# EAGLE design x0x-heart-power (EAGLE 7.2.0)
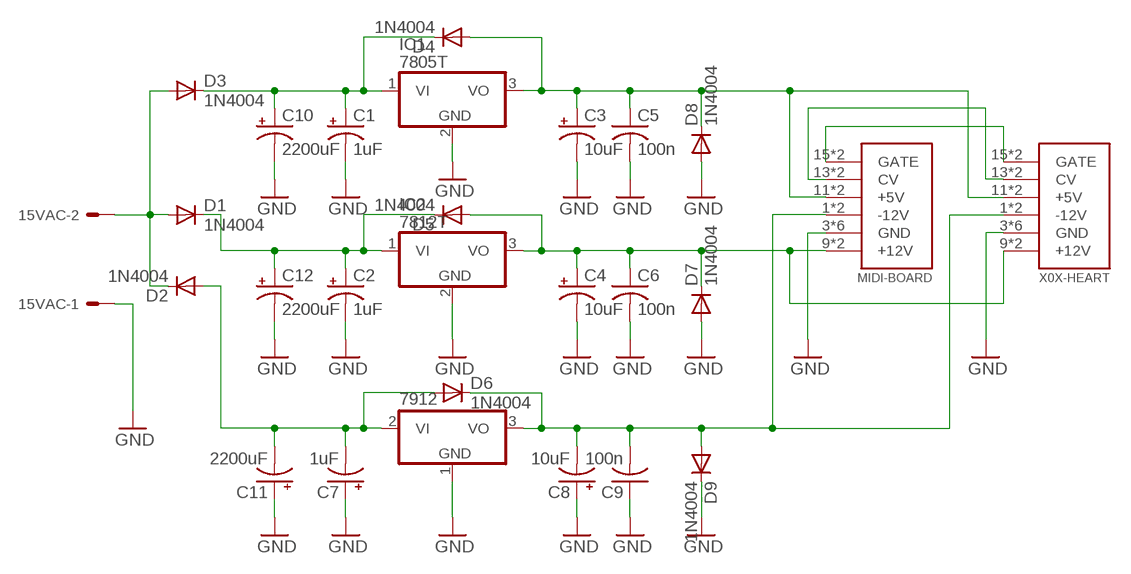
[diagram p0: schematic, sheet 1]

## Parts
15VAC  KK-156-2  [KK-156-2]
7912  7912T  [TO220H]
C1  1uF  CPOL-USE2-5  [E2-5]
C2  1uF  CPOL-USE2-5  [E2-5]
C3  10uF  CPOL-USE2-5  [E2-5]
C4  10uF  CPOL-USE2-5  [E2-5]
C5  100n  C-US025-024X044  [C025-024X044]
C6  100n  C-US025-024X044  [C025-024X044]
C7  1uF  CPOL-USE2-5  [E2-5]
C8  10uF  CPOL-USE2-5  [E2-5]
C9  100n  C-US025-024X044  [C025-024X044]
C10  2200uF  CPOL-USE22-6AXIAL  [E22-6]
C11  2200uF  CPOL-USE22-6AXIAL  [E22-6]
C12  2200uF  CPOL-USE22-6AXIAL  [E22-6]
D1  1N4004  [DO41-10]
D2  1N4004  [DO41-10]
D3  1N4004  [DO41-10]
D4  1N4004  [DO41-10]
D5  1N4004  [DO41-10]
D6  1N4004  [DO41-10]
D7  1N4004  [DO41-10]
D8  1N4004  [DO41-10]
D9  1N4004  [DO41-10]
IC1  7805T  [TO220H]
IC2  7812T  [TO220H]
MIDI-BOARD  POWER  [POWER_16]
X0X-HEART  POWER  [POWER_16]

## Nets
GND: 15VAC.1 7912.1(GND) C1.- C2.- C3.- C4.- C5.2 C6.2 C7.+ C8.+ C9.1 C10.- C11.+ C12.- D7.A D8.A D9.C IC1.2(GND) IC2.2(GND) MIDI-BOARD.3(GND) MIDI-BOARD.4(GND) MIDI-BOARD.5(GND) MIDI-BOARD.6(GND) MIDI-BOARD.7(GND) MIDI-BOARD.8(GND) X0X-HEART.3(GND) X0X-HEART.4(GND) X0X-HEART.5(GND) X0X-HEART.6(GND) X0X-HEART.7(GND) X0X-HEART.8(GND)
N$1: MIDI-BOARD.15(GATE) MIDI-BOARD.16(GATE) X0X-HEART.15(GATE) X0X-HEART.16(GATE)
N$2: MIDI-BOARD.13(CV) MIDI-BOARD.14(CV) X0X-HEART.13(CV) X0X-HEART.14(CV)
N$3: C3.+ C5.1 D4.A D8.C IC1.3(VO) MIDI-BOARD.11(+5V) MIDI-BOARD.12(+5V) X0X-HEART.11(+5V) X0X-HEART.12(+5V)
N$4: 7912.2(VI) C7.- C11.- D2.A D6.A
N$5: 7912.3(VO) C8.- C9.2 D6.C D9.A MIDI-BOARD.1(-12V) MIDI-BOARD.2(-12V) X0X-HEART.1(-12V) X0X-HEART.2(-12V)
N$6: C1.+ C10.+ D3.C D4.C IC1.1(VI)
N$7: C4.+ C6.1 D5.A D7.C IC2.3(VO) MIDI-BOARD.9(+12V) MIDI-BOARD.10(+12V) X0X-HEART.9(+12V) X0X-HEART.10(+12V)
N$8: C2.+ C12.+ D1.C D5.C IC2.1(VI)
N$9: 15VAC.2 D1.A D2.C D3.A

## Library data of the parts
15VAC = con-molex:KK-156-2: KK 156 HEADER Source: http://www.molex.com/pdm_docs/sd/026604100_sd.pdf; OC_FARNELL: unknown; OC_NEWARK: unknown
7912 = linear:79*: Negative VOLTAGE REGULATOR
C1-C4 C7 C8 C10-C12 = rcl:CPOL-US: POLARIZED CAPACITOR, American symbol
C5 C6 C9 = rcl:C-US: CAPACITOR, American symbol
D1-D9 = diode:1N4004: DIODE general purpose rectifier, 1 A
IC1 IC2 = adafruit:78*: Positive VOLTAGE REGULATOR Added bigger pads to the TO-92 package
MIDI-BOARD X0X-HEART = eurorack:POWER

## Board
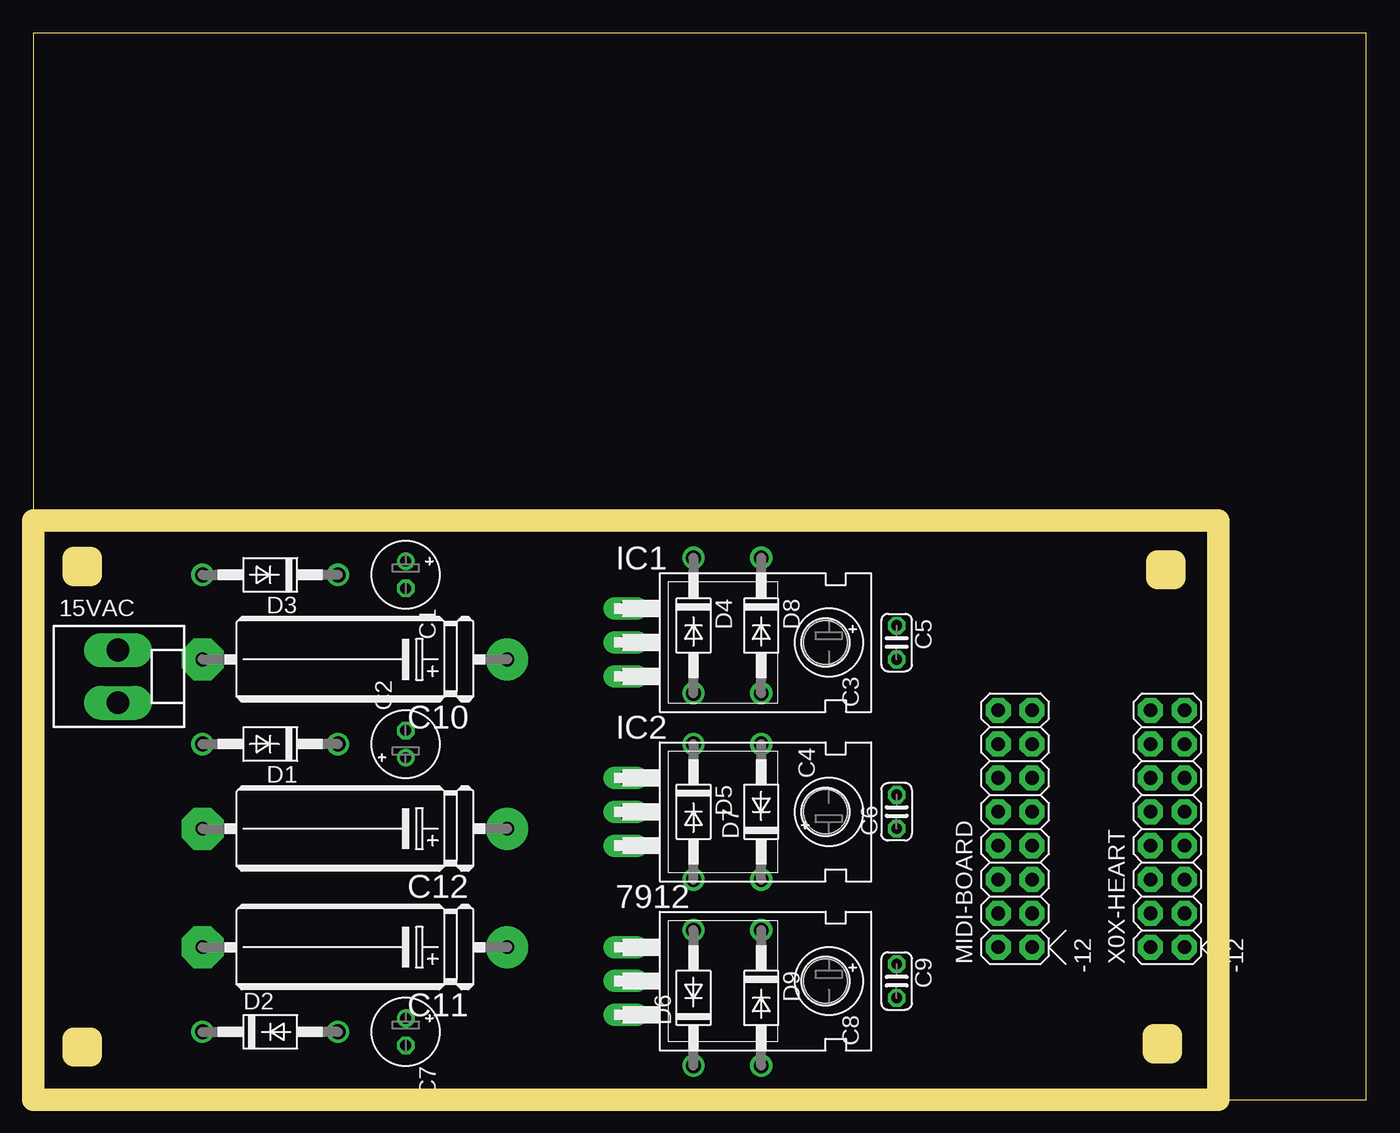
[diagram p1: board, top side]
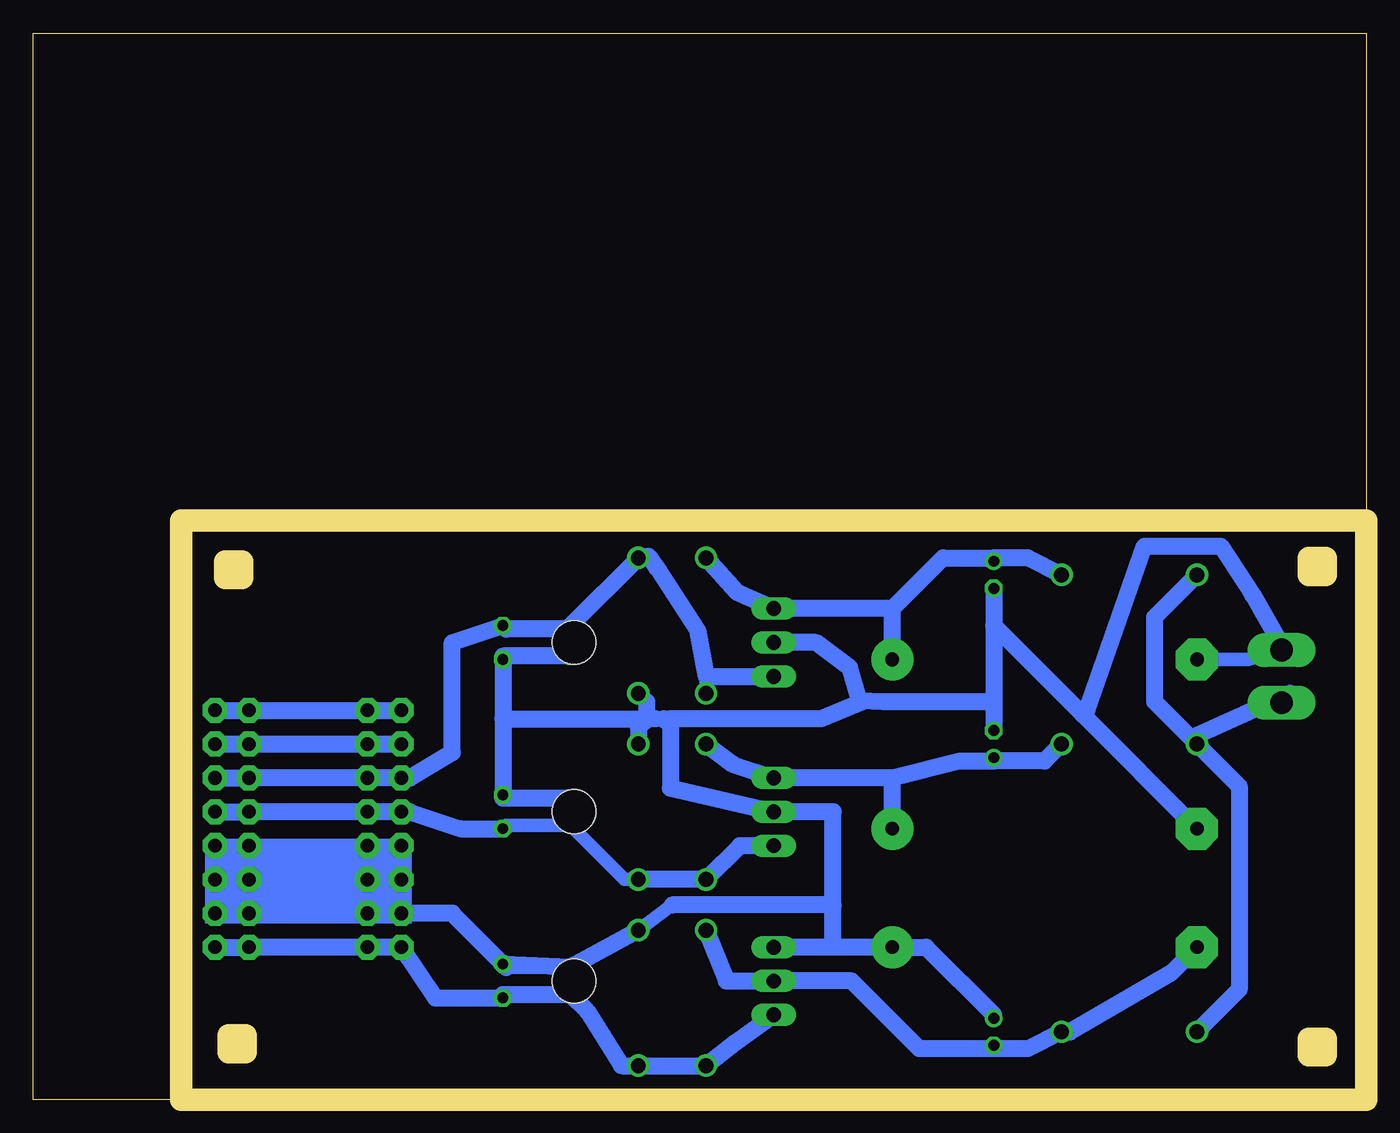
[diagram p2: board, bottom side, seen from below]

Size 100 x 80 mm. Coordinates in mm from the lower left corner, seen from the top.
Outline: 0,0 100,0 100,80 0,80 0,0
Copper layers (1*16): Top 0.035mm / dielectric 1.5mm / Bottom 0.035mm
Design rules "default *": minimum track width 40mil, minimum drill 31mil, track to track 22mil, track to pad 22mil, pad to pad 22mil, via to via 22mil, smd to smd 8mil, copper to edge 0mil, drill to drill 22mil, minimum pad ring 10mil, minimum via ring 8mil, stop-mask expansion 4mil, vias tented up to drill 0mil, thermal gap 10mil
Milling: 20 lines

### Footprints (pad centres in the part's own frame; a part is rotated, then mirrored left to right if it is on the bottom)
KK-156-2 = drill 1.7 pad 2.184 long: 1 -1.98,0; 2 1.98,0
TO220H = drill 1.118 long: 1 -2.54,-10.16; 2 0,-10.16; 3 2.54,-10.16 | hole 3.302: 0,4.826
E2-5 = drill 0.813 pad 1.27: + -1.016,0 | drill 0.813 pad 1.27 octagon: - 1.016,0
C025-024X044 = drill 0.813 octagon: 1 -1.27,0; 2 1.27,0
E22-6 = drill 1.016 pad 3.15: + -11.43,0 | drill 1.016 pad 3.15 octagon: - 11.43,0
DO41-10 = drill 1.118: A 5.08,0; C -5.08,0
POWER_16 = drill 1.016 pad 1.88 octagon: 1 -6.35,-1.27; 2 -6.35,1.27; 3 -3.81,-1.27; 4 -3.81,1.27; 5 -1.27,-1.27; 6 -1.27,1.27; 7 1.27,-1.27; 8 1.27,1.27; 9 3.81,-1.27; 10 3.81,1.27; 11 6.35,-1.27; 12 6.35,1.27; 13 8.89,-1.27; 14 8.89,1.27; 15 11.43,-1.27; 16 11.43,1.27

### Placement (x,y rotation side)
15VAC  6.35,31.75 270 top
7912  54.61,8.89 270 top
C1  27.94,39.37 270 top
C2  27.94,26.67 90 top
C3  59.69,34.29 270 top
C4  59.69,21.59 90 top
C5  64.77,34.29 270 top
C6  64.77,21.59 90 top
C7  27.94,5.08 270 top
C8  59.69,8.89 270 top
C9  64.77,8.89 270 top
C10  24.13,33.02 180 top
C11  24.13,11.43 180 top
C12  24.13,20.32 180 top
D1  17.78,26.67 180 top
D2  17.78,5.08 0 top
D3  17.78,39.37 180 top
D4  49.53,35.56 270 top
D5  49.53,21.59 270 top
D6  49.53,7.62 90 top
D7  54.61,21.59 90 top
D8  54.61,35.56 270 top
D9  54.61,7.62 270 top
IC1  54.61,34.29 270 top
IC2  54.61,21.59 270 top
MIDI-BOARD  73.66,17.78 90 top
X0X-HEART  85.09,17.78 90 top

### Tracks (layer width: path | path; a pad name or v marks a point on that pad's centre or on a via)
GND
  Bottom 1.016: D9.C 52.07,14.61 | 27.94,6.35 C7.+ | 53.34,28.57 52.51,28.38 52.2,28.19 52.2,28.57 52.7,28.57 | C10.- 8.89,33.02 15VAC.1 | 20.95,29.21 21.27,28.89 | 37.85,29.84 38.04,29.91 | 64.77,22.61 C6.2 | 64.77,33.27 C5.2 | C8.+ 64.52,9.91 | MIDI-BOARD.7 MIDI-BOARD.5 MIDI-BOARD.6 MIDI-BOARD.4 MIDI-BOARD.3 MIDI-BOARD.7 | MIDI-BOARD.7 MIDI-BOARD.8 | MIDI-BOARD.7 X0X-HEART.8 X0X-HEART.7 X0X-HEART.5 | X0X-HEART.6 X0X-HEART.5 | X0X-HEART.5 X0X-HEART.3 X0X-HEART.4 | 53.98,29.84 D8.A
  Bottom 1.27: C9.1 C8.+ D9.C | 27.94,6.35 33.02,11.43 C11.+ 40.01,11.43 | 40.01,11.43 7912.1 | 40.01,11.43 40.01,14.61 | 40.01,14.61 40.01,21.59 IC2.2 52.2,23.37 52.2,28.19 | 40.01,14.61 52.07,14.61 | C5.2 64.77,28.57 | 64.77,28.57 C6.2 | 64.77,28.57 53.98,28.57 | C1.- 27.94,35.56 | 27.94,35.56 27.94,29.84 | 27.94,29.84 C2.- | IC1.2 41.27,34.29 38.73,32.38 38.04,29.91 36.2,29.84 27.94,29.84 | 27.94,35.56 21.27,28.89 C12.- | 20.95,29.21 16.64,41.53 10.92,41.53 8.51,37.85 6.48,34.29 15VAC.1 | 52.2,28.57 40.89,28.57 37.85,29.84 | 52.7,28.57 52.51,28.38 | C4.- 64.77,22.61 | C3.- 64.77,33.27 | 64.52,9.91 68.58,13.97 MIDI-BOARD.4 | 53.34,28.57 53.98,28.57 | 53.98,28.57 54.61,27.94 D7.A | 53.98,28.57 53.98,29.84
N$1
  Bottom 1.27: MIDI-BOARD.16 MIDI-BOARD.15 X0X-HEART.16 X0X-HEART.15
N$2
  Bottom 1.27: MIDI-BOARD.14 MIDI-BOARD.13 X0X-HEART.14 X0X-HEART.13
N$3
  Bottom 1.016: D4.A 49.53,31.75 | MIDI-BOARD.12 71.75,24.13 | 53.85,40.77 54.61,40.77 D8.C | C3.+ 59.69,35.56 | 64.52,35.31 C5.1
  Bottom 1.27: IC1.3 49.53,31.75 50.16,35.18 53.21,39.88 53.85,40.77 | X0X-HEART.11 X0X-HEART.12 MIDI-BOARD.11 MIDI-BOARD.12 | C5.1 68.58,34.29 68.58,26.04 71.75,24.13 | 59.69,35.56 D8.C | C3.+ 64.52,35.31
N$4
  Bottom 1.016: 22.23,5.08 D2.A | 27.94,3.81 C7.-
  Bottom 1.27: D6.A 48.01,8.89 7912.2 38.61,8.89 33.53,3.81 27.94,3.81 25.4,3.81 D2.A | 22.23,5.08 14.61,9.53 C11.-
N$5
  Bottom 1.016: 64.77,7.87 C9.2
  Bottom 1.27: 7912.3 47.24,4.32 D6.C D9.A 55.88,2.54 58.42,6.6 C8.- 64.77,7.87 | X0X-HEART.1 X0X-HEART.2 MIDI-BOARD.1 MIDI-BOARD.2 69.85,7.62 C9.2
N$6
  Bottom 1.016: 27.94,40.64 C1.+
  Bottom 1.27: D4.C 47.24,38.1 IC1.1 35.56,36.83 | D3.C 25.4,40.64 27.94,40.64 31.75,40.64 35.56,36.83 | C10.+ 35.56,36.83
N$7
  Bottom 1.016: MIDI-BOARD.10 71.75,21.59 | D7.C 55.63,16.51 C4.+ 64.52,20.57 C6.1
  Bottom 1.27: X0X-HEART.9 X0X-HEART.10 MIDI-BOARD.9 MIDI-BOARD.10 | C6.1 67.94,20.32 71.75,21.59 | IC2.3 46.99,19.05 D5.A D7.C
N$8
  Bottom 1.016: 27.94,25.4 C2.+
  Bottom 1.27: D5.C 47.5,25.15 IC2.1 35.56,24.13 | D1.C 24.13,25.4 27.94,25.4 30.48,25.4 35.56,24.13 | C12.+ 35.56,24.13
N$9
  Bottom 1.016: 5.71,30.48 6.99,29.21 15VAC.2 | 12.7,27.3 D1.A
  Bottom 1.27: D2.C 9.53,8.26 9.53,23.5 D1.A 15.88,29.84 15.88,36.2 D3.A | 12.7,27.3 5.71,30.48
(copper drawn outside any net)
  shapes: Bottom area x3